# Altium project MB1520.PrjPcb (part 3 of 5)

## Sheet Ethernet.SchDoc: Ethernet
size A4; CompanyName: STMicroelectronics; Organization: Microcontrollers Division; DocumentNumber: 7; SheetNumber: 5; SheetTotal: 19
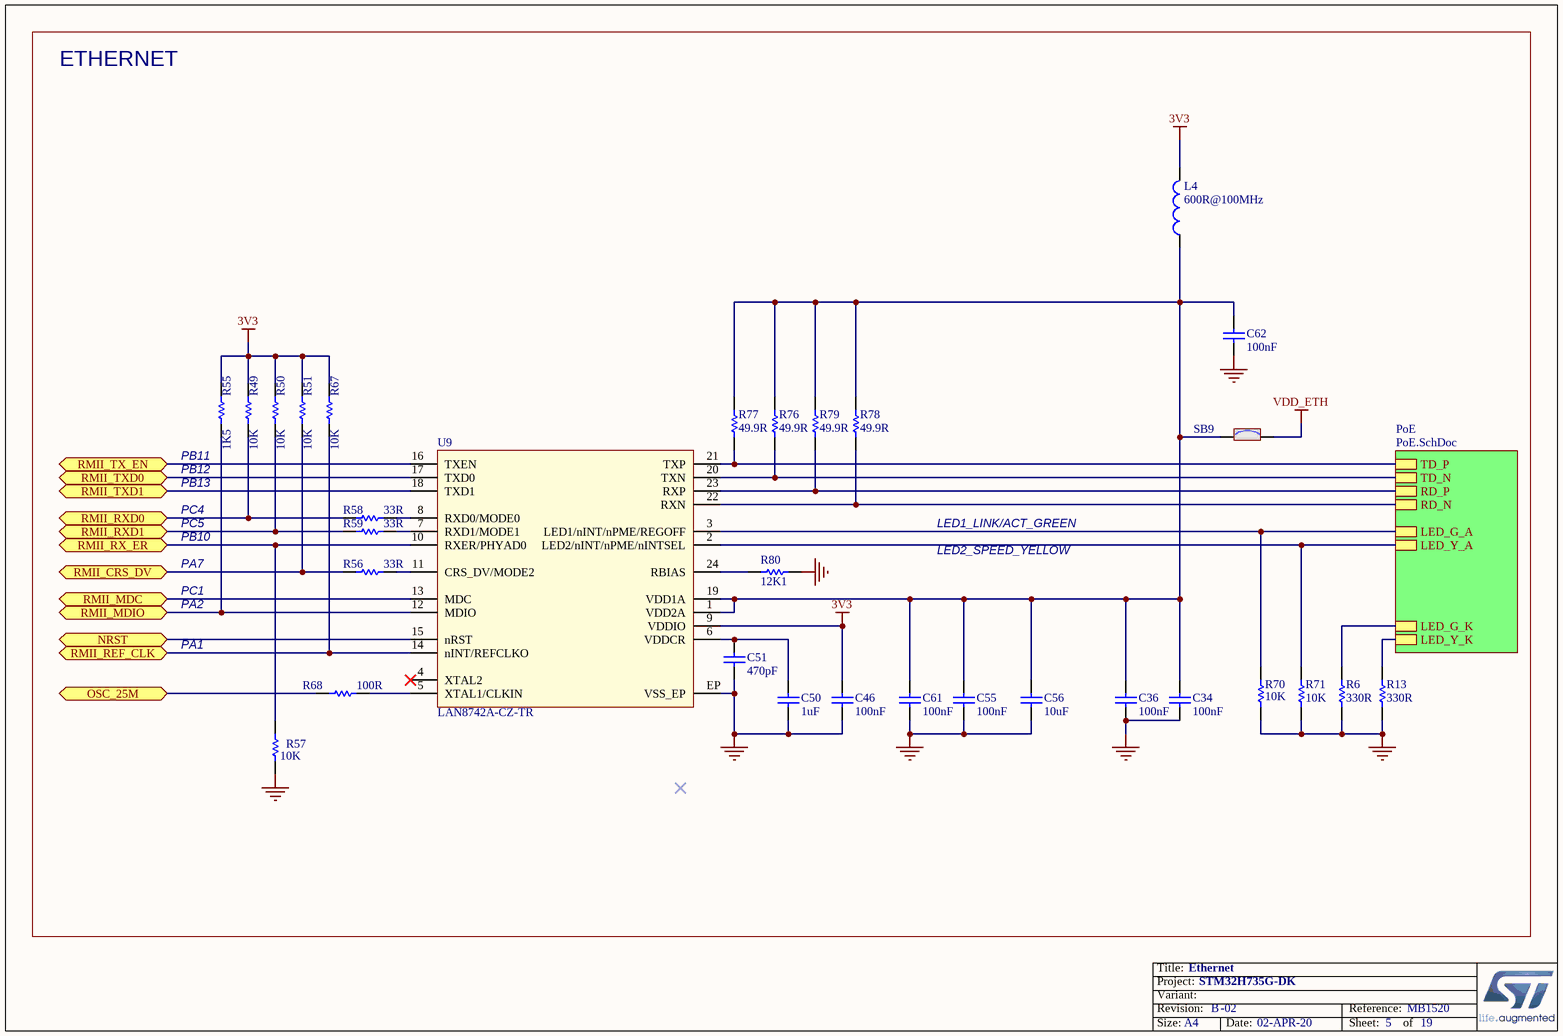
[diagram p9: Ethernet.SchDoc]

### Parts
C34  value 100nF  [C0402]  (hidden comment: Capacitor)
C36  value 100nF  [C0402]  (hidden comment: Capacitor)
C46  value 100nF  [C0402]  (hidden comment: Capacitor)
C50  value 1uF  [C0603]  (hidden comment: Capacitor)
C51  value 470pF  [C0402]  (hidden comment: Capacitor)
C55  value 100nF  [C0402]  (hidden comment: Capacitor)
C56  value 10uF  [C0603]  (hidden comment: Capacitor)
C61  value 100nF  [C0402]  (hidden comment: Capacitor)
C62  value 100nF  [C0402]  (hidden comment: Capacitor)
L4  value 600R@100MHz  [L0603]  (hidden comment: BEAD)
R6  value 330R  [R0402]  (hidden comment: Resistor)
R13  value 330R  [R0402]  (hidden comment: Resistor)
R49  value 10K  [R0402]  (hidden comment: Resistor)
R50  value 10K  [R0402]  (hidden comment: Resistor)
R51  value 10K  [R0402]  (hidden comment: Resistor)
R55  value 1K5  [R0402]  (hidden comment: Resistor)
R56  value 33R  [R0402]  (hidden comment: Resistor)
R57  value 10K  [R0402]  (hidden comment: Resistor)
R58  value 33R  [R0402]  (hidden comment: Resistor)
R59  value 33R  [R0402]  (hidden comment: Resistor)
R67  value 10K  [R0402]  (hidden comment: Resistor)
R68  value 100R  [R0402]  (hidden comment: Resistor)
R70  value 10K  [R0402]  (hidden comment: Resistor)
R71  value 10K  [R0402]  (hidden comment: Resistor)
R76  value 49.9R  [R0402]  (hidden comment: Resistor)
R77  value 49.9R  [R0402]  (hidden comment: Resistor)
R78  value 49.9R  [R0402]  (hidden comment: Resistor)
R79  value 49.9R  [R0402]  (hidden comment: Resistor)
R80  value 12K1  [R0402]  (hidden comment: Resistor)
SB9  SB_ON  [SOLDER-BRIDGE_R0603-0R]  (value not drawn)
U9  LAN8742A-CZ-TR  [ICC_VQFN24-EPAD_4X4_P050]

### Sub-sheets
PoE = PoE.SchDoc: LED_G_A, LED_G_K, LED_Y_A, LED_Y_K, RD_P, TD_N, TD_P, RD_N

### Ports
NRST, OSC_25M, RMII_CRS_DV, RMII_MDC, RMII_MDIO, RMII_REF_CLK, RMII_RX_ER, RMII_RXD0, RMII_RXD1, RMII_TX_EN, RMII_TXD0, RMII_TXD1

### Nets
3V3: C46.1 L4.2 R49.2 R50.2 R51.1 R55.2 R67.1 U9.9(VDDIO)
GND: C34.2 C36.2 C46.2 C50.1 C51.1 C55.2 C56.1 C61.2 C62.1 R6.1 R13.1 R57.2 R70.2 R71.1 R80.2 U9.EP(VSS_EP)  [project net POE7]
VDD_ETH: SB9.2
OSC_25M: R68.1 ; port OSC_25M
RESET: U9.15(nRST) ; port NRST
RMII_CRS_DV: R51.2 R56.1 ; port RMII_CRS_DV
RMII_MDC: U9.13(MDC) ; port RMII_MDC
RMII_MDIO: R55.1 U9.12(MDIO) ; port RMII_MDIO
RMII_REF_CLK: R67.2 U9.14(nINT/REFCLKO) ; port RMII_REF_CLK
RMII_RX_ER: R57.1 U9.10(RXER/PHYAD0) ; port RMII_RX_ER
RMII_RXD0: R49.1 R58.1 ; port RMII_RXD0
RMII_RXD1: R50.1 R59.1 ; port RMII_RXD1
RMII_TX_EN: U9.16(TXEN) ; port RMII_TX_EN
RMII_TXD0: U9.17(TXD0) ; port RMII_TXD0
RMII_TXD1: U9.18(TXD1) ; port RMII_TXD1
NetC34_1: C34.1 C36.1 C55.1 C56.2 C61.1 C62.2 L4.1 R76.2 R77.2 R78.2 R79.2 SB9.1 U9.1(VDD2A) U9.19(VDD1A)
NetC50_2: C50.2 C51.2 U9.6(VDDCR)
NetR6_2: R6.2 ; sheet PoE/LED_G_K
NetR13_2: R13.2 ; sheet PoE/LED_Y_K
NetR56_2: R56.2 U9.11(CRS_DV/MODE2)
NetR58_2: R58.2 U9.8(RXD0/MODE0)
NetR59_2: R59.2 U9.7(RXD1/MODE1)
NetR68_2: R68.2 U9.5(XTAL1/CLKIN)
NetR70_1: R70.1 U9.3(LED1/nINT/nPME/REGOFF) ; sheet PoE/LED_G_A
NetR71_2: R71.2 U9.2(LED2/nINT/nPME/nINTSEL) ; sheet PoE/LED_Y_A
NetR76_1: R76.1 U9.20(TXN) ; sheet PoE/TD_N
NetR77_1: R77.1 U9.21(TXP) ; sheet PoE/TD_P
NetR78_1: R78.1 U9.22(RXN) ; sheet PoE/RD_N
NetR79_1: R79.1 U9.23(RXP) ; sheet PoE/RD_P
NetR80_1: R80.1 U9.24(RBIAS)

Not connected (* = marked no-connect by the designer): U9 4(XTAL2)*

### Notes on the sheet
- ETHERNET
- PB11
- PB12
- PB13
- PC4
- PA7
- PC5
- PB10
- LED1_LINK/ACT_GREEN
- LED2_SPEED_YELLOW
- PA2
- PC1
- PA1
- Title:
- Project:
- Size:
- Revision:
- Variant:
- A4
- -
- Date:
- Reference:
- Sheet:
- of

### Library data of the parts
C34 C36 C46 C55 C61 C62 = MCD-00102: Capacitor, MLCC, 100nF, 16V, X7R, 10%, 0402, T=0,5mm; Manufacturer_Part_Number: CC0402KRX7R7BB104; Manufacturer: YAGEO; Alternate_Manufacturer_Part_Number: GCM155R71C104KA55D; Alternate_Manufacturer: MURATA; Provided_By: SUBCO; Internal_Part_Number: MCD-00102; Status: Released; Part_Type: Capacitor; Package: C0402; ComponentLink1Description: Datasheet; ComponentLink1URL: http://tunmcdsvn.tun.st.com/Component_Datasheet_Library/Trunk/Capacitors/Yageo_Multilayer_Capacitor_X7R_series_100pF_to_22uF
C50 = MCD-00010: Capacitor, MLCC, 1uF, 16V, X5R, 10%, 0603, T=0,8mm; Manufacturer_Part_Number: CC0603KRX5R7BB105; Manufacturer: YAGEO; Provided_By: SUBCO; Internal_Part_Number: MCD-00010; Status: Released; Part_Type: Capacitor; Package: C0603; ComponentLink1Description: Datasheet; ComponentLink1URL: http://tunmcdsvn.tun.st.com/Component_Datasheet_Library/Trunk/Capacitors/Yageo_Multilayer_capacitor_X5R_series_100pF_to_100uF
C51 = MCD-00724: Capacitor, MLCC, 470pF, 50V, NPO, 5%, 0402, T=0,5mm; Manufacturer_Part_Number: CC0402JRNPO9BN471; Manufacturer: YAGEO; Provided_By: SUBCO; Internal_Part_Number: MCD-00724; Status: Released; Part_Type: Capacitor; Package: C0402; ComponentLink1Description: Datasheet; ComponentLink1URL: http://tunmcdsvn.tun.st.com/Component_Datasheet_Library/Trunk/Capacitors/Yageo_Capacitor_NP0_16V-to-50V
C56 = MCD-01124: Capacitor, MLCC, 10uF, 10V, X5R, 10%, 0603, T=0.8mm; Manufacturer_Part_Number: GRM188R61A106KAAL; Manufacturer: MURATA; ECCN_US: EAR99; ECCN_EU: NEC; Provided_By: SUBCO; Internal_Part_Number: MCD-01124; Status: Released; Part_Type: Capacitor; Package: C0603; ComponentLink1Description: Datasheet; ComponentLink1URL: http://tunmcdsvn.tun.st.com/Component_Datasheet_Library/Trunk/Capacitors/Murata_Capacitor_GR_series
L4 = MCD-00047: SMD Chip ferrite bead, 600R@100MHz +/-25%, 350mA, 500mohm DC, 0603, T=0.8mm; Part_Type: Inductor; Manufacturer_Part_Number: FCM1608KF-601T03; Manufacturer: TAI-TECH; Provided_By: SUBCO; Internal_Part_Number: MCD-00047; Status: Released; ComponentLink1Description: Datasheet; ComponentLink1URL: http://tunmcdsvn.tun.st.com/Component_Datasheet_Library/Trunk/Inductors/TaiTech_Bead_FCM1608_series; ECCN_US: n/a; ECCN_EU: n/a
R6 R13 = MCD-00062: Resistor,330R,0402,1%,1/16W; Manufacturer_Part_Number: RC0402FR-07330RL; Manufacturer: YAGEO; Provided_By: SUBCO; Internal_Part_Number: MCD-00062; Status: Released; Part_Type: Resistor; Package: R0402; ComponentLink1Description: Datasheet; ComponentLink1URL: http://tunmcdsvn.tun.st.com/Component_Datasheet_Library/Trunk/Resistors/Yageo_Resistor_RC0402-series
R49-R51 R57 R67 = MCD-00053: Resistor,10K,0402,1%,1/16W; Manufacturer_Part_Number: RC0402FR-0710KL; Manufacturer: YAGEO; ECCN_US: EAR99; ECCN_EU: NEC; Provided_By: SUBCO; Internal_Part_Number: MCD-00053; Status: Released; Part_Type: Resistor; Package: R0402; ComponentLink1Description: Datasheet; ComponentLink1URL: http://tunmcdsvn.tun.st.com/Component_Datasheet_Library/Trunk/Resistors/Yageo_Resistor_RC0402-series
R55 = MCD-00068: Resistor,1K5,0402,1%,1/16W; Manufacturer_Part_Number: RC0402FR-071K5L; Manufacturer: YAGEO; ECCN_US: EAR99; ECCN_EU: NEC; Provided_By: SUBCO; Internal_Part_Number: MCD-00068; Status: Released; Part_Type: Resistor; Package: R0402; ComponentLink1Description: Datasheet; ComponentLink1URL: http://tunmcdsvn.tun.st.com/Component_Datasheet_Library/Trunk/Resistors/Yageo_Resistor_RC0402-series
R56 R58 R59 = MCD-00455: Resistor,33R,0402,1%,1/16W; Manufacturer_Part_Number: RC0402FR-0733RL; Manufacturer: YAGEO; ECCN_US: EAR99; ECCN_EU: NEC; Provided_By: SUBCO; Internal_Part_Number: MCD-00455; Status: Released; Part_Type: Resistor; Package: R0402; ComponentLink1Description: Datasheet; ComponentLink1URL: http://tunmcdsvn.tun.st.com/Component_Datasheet_Library/Trunk/Resistors/Yageo_Resistor_RC0402-series
R68 = MCD-00119: Resistor,100R,0402,1%,1/16W; Manufacturer_Part_Number: RC0402FR-07100RL; Manufacturer: YAGEO; Provided_By: SUBCO; Internal_Part_Number: MCD-00119; Status: Released; Part_Type: Resistor; ComponentLink1Description: Datasheet; Package: R0402; ComponentLink1URL: http://tunmcdsvn.tun.st.com/Component_Datasheet_Library/Trunk/Resistors/Yageo_Resistor_RC0402-series
R70 R71 = MCD-00053: Resistor,10K,0402,1%,1/16W; Manufacturer_Part_Number: RC0402FR-0710KL; Manufacturer: YAGEO; Provided_By: SUBCO; Internal_Part_Number: MCD-00053; Status: Released; Part_Type: Resistor; Package: R0402; ComponentLink1Description: Datasheet; ComponentLink1URL: http://tunmcdsvn.tun.st.com/Component_Datasheet_Library/Trunk/Resistors/Yageo_Resistor_RC0402-series
R76-R79 = MCD-00565: Resistor,49R9,0402,1%,1/16W; Manufacturer_Part_Number: RC0402FR-0749R9L; Manufacturer: YAGEO; Provided_By: SUBCO; Internal_Part_Number: MCD-00565; Status: Released; Part_Type: Resistor; Package: R0402; ComponentLink1Description: Datasheet; ComponentLink1URL: http://tunmcdsvn.tun.st.com/Component_Datasheet_Library/Trunk/Resistors/Yageo_Resistor_RC0402-series
R80 = MCD-00723: Resistor,12K1,0402,1%,1/16W; Manufacturer_Part_Number: RC0402FR-0712K1L; Manufacturer: YAGEO; ECCN_US: EAR99; ECCN_EU: NEC; Provided_By: SUBCO; Internal_Part_Number: MCD-00723; Status: Released; Part_Type: Resistor; Package: R0402; ComponentLink1Description: Datasheet; ComponentLink1URL: http://tunmcdsvn.tun.st.com/Component_Datasheet_Library/Trunk/Resistors/Yageo_Resistor_RC0402-series
SB9 = MCD-00071: as SB6-SB8 on sheet STMod+; Internal_Part_Number: MCD-00071; Status: Released; Package: SB0603; ComponentLink1Description: Datasheet; ComponentLink1URL: http://tunmcdsvn.tun.st.com/Component_Datasheet_Library/Trunk/Resistors/Yageo_Resistor_RC0603-series
U9 = MCD-00719: 10/100M RMII Ethernet transceiver; Part_Type: IC; Manufacturer: MICROCHIP; Provided_By: SUBCO; Internal_Part_Number: MCD-00719; Value: LAN8742A-CZ-TR; Status: Released; Manufacturer_Part_Number: LAN8742A-CZ-TR; ComponentLink1Description: Datasheet; ComponentLink1URL: http://tunmcdsvn.tun.st.com/Component_Datasheet_Library/Trunk/IC/MICROCHIP_LAN8742A_RMII_PHY; ECCN_US: n/a; ECCN_EU: n/a

## Sheet PoE.SchDoc: PoE
size A4; CompanyName: STMicroelectronics; Organization: Microcontrollers Division; DocumentNumber: 13; SheetNumber: 6; SheetTotal: 19
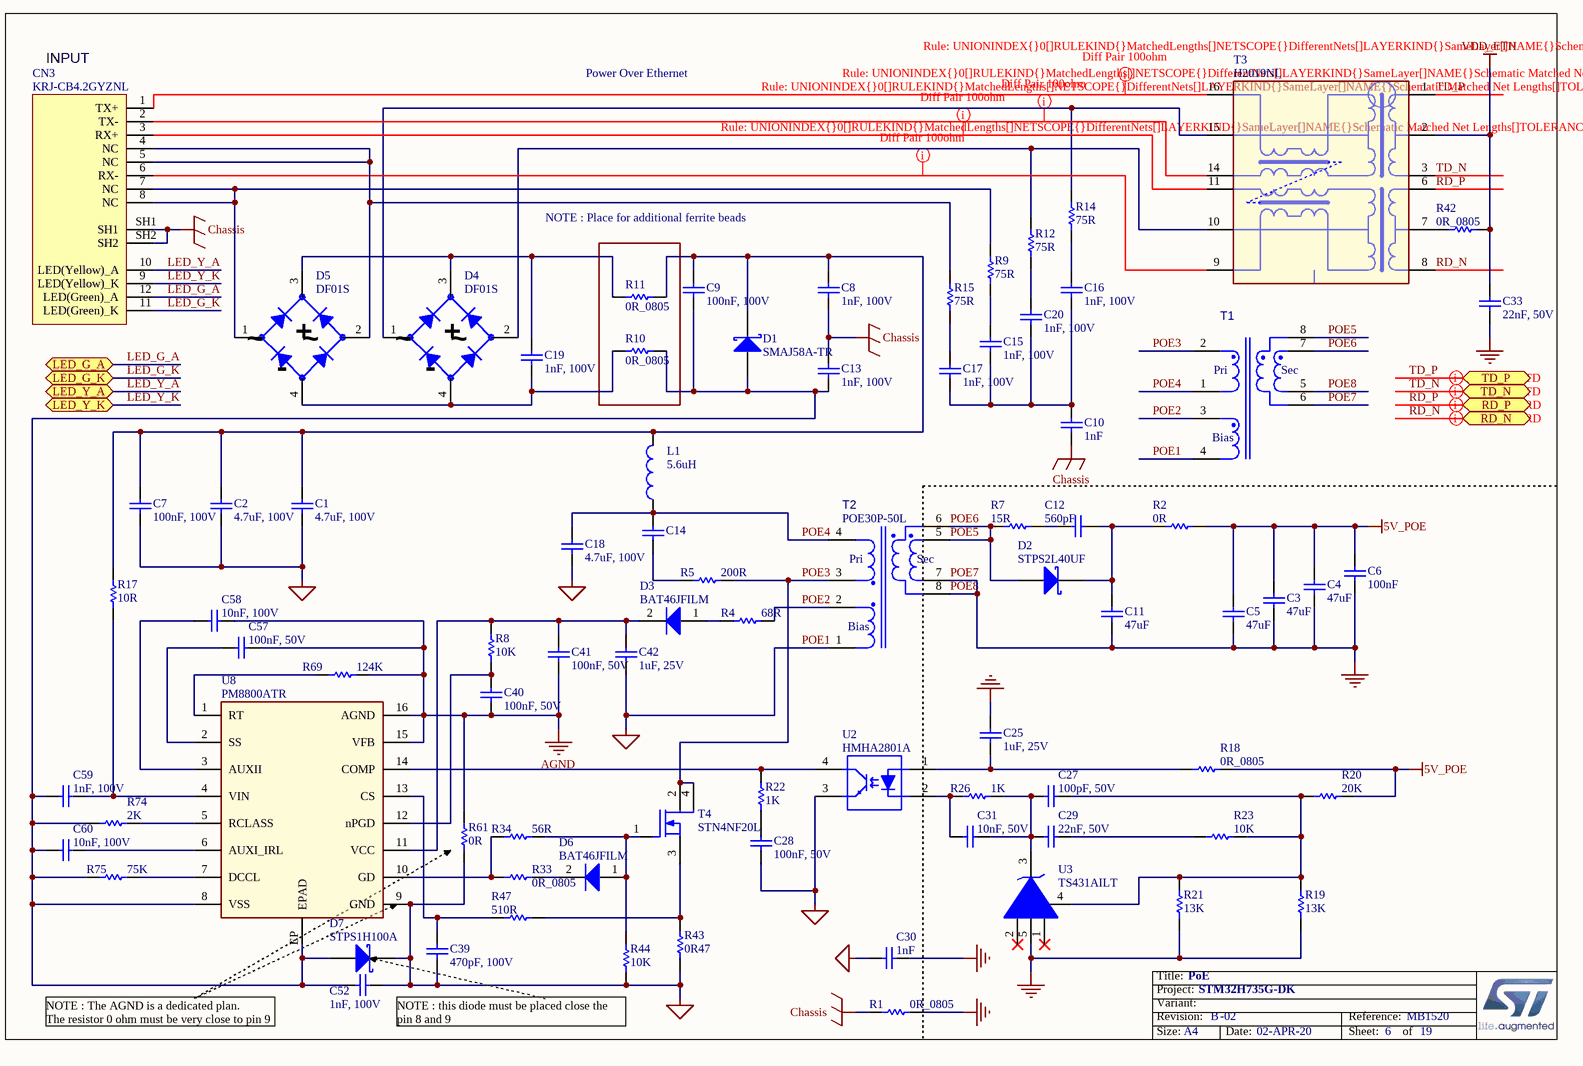
[diagram p10: PoE.SchDoc]

### Parts
C1  value 4.7uF, 100V  [C1210]  (hidden comment: Capacitor)
C2  value 4.7uF, 100V  [C1210]  (hidden comment: Capacitor)
C3  value 47uF  [C0805]  (hidden comment: Capacitor)
C4  value 47uF  [C0805]  (hidden comment: Capacitor)
C5  value 47uF  [C0805]  (hidden comment: Capacitor)
C6  value 100nF  [C0603]  (hidden comment: Capacitor)
C7  value 100nF, 100V  [C0805]  (hidden comment: Capacitor)
C8  value 1nF, 100V  [C0603]  (hidden comment: Capacitor)
C9  value 100nF, 100V  [C0805]  (hidden comment: Capacitor)
C10  value 1nF  [C1206_H1P6]  (hidden comment: Capacitor)
C11  value 47uF  [C0805]  (hidden comment: Capacitor)
C12  value 560pF  [C0603]  (hidden comment: Capacitor)
C13  value 1nF, 100V  [C0603]  (hidden comment: Capacitor)
C14  Capacitor  [C0603]  (value not drawn)
C15  value 1nF, 100V  [C0603]  (hidden comment: Capacitor)
C16  value 1nF, 100V  [C0603]  (hidden comment: Capacitor)
C17  value 1nF, 100V  [C0603]  (hidden comment: Capacitor)
C18  value 4.7uF, 100V  [C1210]  (hidden comment: Capacitor)
C19  value 1nF, 100V  [C0603]  (hidden comment: Capacitor)
C20  value 1nF, 100V  [C0603]  (hidden comment: Capacitor)
C25  value 1uF, 25V  [C0603]  (hidden comment: Capacitor)
C27  value 100pF, 50V  [C0603]  (hidden comment: Capacitor)
C28  value 100nF, 50V  [C0603]  (hidden comment: Capacitor)
C29  value 22nF, 50V  [C0603]  (hidden comment: Capacitor)
C30  value 1nF  [C1206_H1P6]  (hidden comment: Capacitor)
C31  value 10nF, 50V  [C0603]  (hidden comment: Capacitor)
C33  value 22nF, 50V  [C0603]  (hidden comment: Capacitor)
C39  value 470pF, 100V  [C0603]  (hidden comment: Capacitor)
C40  value 100nF, 50V  [C0603]  (hidden comment: Capacitor)
C41  value 100nF, 50V  [C0603]  (hidden comment: Capacitor)
C42  value 1uF, 25V  [C0603]  (hidden comment: Capacitor)
C52  value 1nF, 100V  [C0603]  (hidden comment: Capacitor)
C57  value 100nF, 50V  [C0603]  (hidden comment: Capacitor)
C58  value 10nF, 100V  [C0603]  (hidden comment: Capacitor)
C59  value 1nF, 100V  [C0603]  (hidden comment: Capacitor)
C60  value 10nF, 100V  [C0603]  (hidden comment: Capacitor)
CN3  value KRJ-CB4.2GYZNL  [CON_RJ45_DGKYD_KRJ-CB4.2GYZNL]  (hidden comment: RJ45_KRJ-CB4.2GYZNL)
D1  SMAJ58A-TR  [DIO_SMA_1A_2K]
D2  STPS2L40UF  [DIO_SMB-FLAT_1A_2K]
D3  value BAT46JFILM  [DIO_SOD323_1A_2K]  (hidden comment: DIODE_1A_2K)
D4  DF01S  [BRF_VISHAY_DFS_DF01S]
D5  DF01S  [BRF_VISHAY_DFS_DF01S]
D6  value BAT46JFILM  [DIO_SOD323_1A_2K]  (hidden comment: DIODE_1A_2K)
D7  value STPS1H100A  [DIO_SMA_DO214-AC_1A_2K]  (hidden comment: SMAJ58A-TR)
L1  value 5.6uH  [IND_POWER_COILCRAFT_ME3220]  (hidden comment: Inductor)
R1  value 0R_0805  [R0805]  (hidden comment: Resistor)
R2  value 0R  [R0603]  (hidden comment: Resistor)
R4  value 68R  [R0805]  (hidden comment: Resistor)
R5  value 200R  [R1206_H0P55]  (hidden comment: Resistor)
R7  value 15R  [R0805]  (hidden comment: Resistor)
R8  value 10K  [R0603]  (hidden comment: Resistor)
R9  value 75R  [R0805]  (hidden comment: Resistor)
R10  value 0R_0805  [R0805]  (hidden comment: Resistor)
R11  value 0R_0805  [R0805]  (hidden comment: Resistor)
R12  value 75R  [R0805]  (hidden comment: Resistor)
R14  value 75R  [R0805]  (hidden comment: Resistor)
R15  value 75R  [R0805]  (hidden comment: Resistor)
R17  value 10R  [R0805]  (hidden comment: Resistor)
R18  value 0R_0805  [R0805]  (hidden comment: Resistor)
R19  value 13K  [R0603]  (hidden comment: Resistor)
R20  value 20K  [R0603]  (hidden comment: Resistor)
R21  value 13K  [R0603]  (hidden comment: Resistor)
R22  value 1K  [R0603]  (hidden comment: Resistor)
R23  value 10K  [R0603]  (hidden comment: Resistor)
R26  value 1K  [R0603]  (hidden comment: Resistor)
R33  value 0R_0805  [R0805]  (hidden comment: Resistor)
R34  value 56R  [R0805]  (hidden comment: Resistor)
R42  value 0R_0805  [R0805]  (hidden comment: Resistor)
R43  value 0R47  [R1206_H0P55]  (hidden comment: Resistor)
R44  value 10K  [R0603]  (hidden comment: Resistor)
R47  value 510R  [R0603]  (hidden comment: Resistor)
R61  value 0R  [R0603]  (hidden comment: Resistor)
R69  value 124K  [R0603]  (hidden comment: Resistor)
R74  value 2K  [R0805]  (hidden comment: Resistor)
R75  value 75K  [R0603]  (hidden comment: Resistor)
T1  TRS_750315923  [TRS_WURTH_750315923]  (value not drawn)
T2  POE30P-50L  [TRS_COILCRAFT_POE30P-50L]
T3  H2019NL  [TRS_PULSE_H2019NL]
T4  STN4NF20L  [MOS_SOT223-TAB]
U2  HMHA2801A  [OPT_MINI-FLAT_FAIRCHILD_HMHA2801A]
U3  TS431AILT  [MOS_SOT23-5L]
U8  PM8800ATR  [ICC_HTSSOP16-EPAD_5X4P4_P065]

### Ports
LED_G_A, LED_G_K, LED_Y_A, LED_Y_K, RD_N, RD_P, TD_N, TD_P

### Nets
5V_POE: C3.2 C4.2 C5.2 C6.2 R2.2 R18.2 R20.2
AGND: C40.1 C41.1 C57.2 C58.2 R61.2 R69.2 U8.15(VFB) U8.16(AGND)
Chassis: C8.1 C10.1 C13.2 CN3.SH1 CN3.SH2 R1.1
POE1: C1.1 C2.1 C7.1 C18.1 C28.1 C30.1 C39.1 C42.1 C52.1 D7.2(K) R43.1 R44.1 R61.1 T1.4 T2.1 U2.3(Emitter) U8.9(GND)  [also labelled GND_POWER_IN]
POE7: C3.1 C4.1 C5.1 C6.1 C11.1 C25.2 C30.2 C33.1 R1.2 R19.2 R21.1 T1.5 T1.6 T2.7 T2.8 U3.5(A)  [also labelled GND, POE8]
VDD_ETH: C33.2 R42.2 T3.2(tct)
LED_G_A: CN3.12(LED(Green)_A) ; port LED_G_A
LED_G_K: CN3.11(LED(Green)_K) ; port LED_G_K
LED_Y_A: CN3.10(LED(Yellow)_A) ; port LED_Y_A
LED_Y_K: CN3.9(LED(Yellow)_K) ; port LED_Y_K
POE2: R4.2 T1.3 T2.2
POE3: R5.2 T1.2 T2.3 T4.2(D) T4.4(D)
POE4: C14.2 C18.2 L1.1 T1.1 T2.4
POE5: D2.1(A) R7.1 T1.7 T1.8 T2.5 T2.6  [also labelled POE6]
RD_N: T3.8(rd-) ; port RD_N
RD_P: T3.6(rd+) ; port RD_P
TD_N: T3.3(td-) ; port TD_N
TD_P: T3.1(td+) ; port TD_P
NetC1_2: C1.2 C2.2 C7.2 C8.2 C9.1 D1.2(K) L1.2 R11.2 R17.2
NetC9_2: C9.2 C13.1 C52.2 C59.2 C60.1 D1.1(A) D7.1(A) R10.2 R74.1 R75.1 U8.8(VSS) U8.EP(EPAD)
NetC10_2: C10.2 C15.1 C16.1 C17.1 C20.1
NetC11_2: C11.2 C12.2 D2.2(K) R2.1
NetC12_1: C12.1 R7.2
NetC14_1: C14.1 R5.1
NetC15_2: C15.2 R9.1
NetC16_2: C16.2 R14.1
NetC17_2: C17.2 R15.1
NetC19_1: C19.1 D4.4(DC_OUT_MINUS) D5.4(DC_OUT_MINUS) R10.1
NetC19_2: C19.2 D4.3(DC_OUT_PLUS) D5.3(DC_OUT_PLUS) R11.1
NetC20_2: C20.2 R12.1
NetC25_1: C25.1 R18.1 U2.1(Anode)
NetC27_1: C27.1 C29.1 C31.2 R26.1 U3.3(K)
NetC27_2: C27.2 R19.1 R20.1 R21.2 R23.1 U3.4(REF)
NetC28_2: C28.2 R22.1
NetC29_2: C29.2 R23.2
NetC31_1: C31.1 R26.2 U2.2(B)
NetC39_2: C39.2 R47.1 U8.13(CS)
NetC40_2: C40.2 R8.1 U8.12(nPGD)
NetC41_2: C41.2 C42.2 D3.2(K) R8.2 U8.11(VCC)
NetC57_1: C57.1 U8.2(SS)
NetC58_1: C58.1 U8.3(AUXII)
NetC59_1: C59.1 R17.1 U8.4(VIN)
NetC60_2: C60.2 U8.6(AUXI_IRL)
NetCN3_1: CN3.1(TX+) T3.16(tx1+)
NetCN3_2: CN3.2(TX-) T3.14(tx1-)
NetCN3_3: CN3.3(RX+) T3.11(rx1+)
NetCN3_4: CN3.4(NC) CN3.5(NC) D5.2(AC_IN_2) R15.2
NetCN3_6: CN3.6(RX-) T3.9(rx-)
NetCN3_7: CN3.7(NC) CN3.8(NC) D5.1(AC_IN_1) R9.2
NetD3_1: D3.1(A) R4.1
NetD4_1: D4.1(AC_IN_1) R14.2 T3.15(txct)
NetD4_2: D4.2(AC_IN_2) R12.2 T3.10(rxct)
NetD6_1: D6.1(A) R34.2 R44.2 T4.1(G)
NetD6_2: D6.2(K) R33.1
NetR22_2: R22.2 U2.4(Collector) U8.14(COMP)
NetR33_2: R33.2 R34.1 U8.10(GD)
NetR42_1: R42.1 T3.7(rct)
NetR43_2: R43.2 R47.2 T4.3(S)
NetR69_1: R69.1 U8.1(RT)
NetR74_2: R74.2 U8.5(RCLASS)
NetR75_2: R75.2 U8.7(DCCL)

Not connected (* = marked no-connect by the designer): U3 1(NC)* 2(NC)*

### Layout directives
differential pair: RD_N, RD_P, TD_N, TD_P
rule Matched Net Lengths [Tolerance = 100mil]: NetCN3_1, NetCN3_2, NetCN3_3, NetCN3_6

### Notes on the sheet
- INPUT
- Power Over Ethernet
- NOTE : Place for additional ferrite beads
- NOTE : The AGND is a dedicated plan.
  The resistor 0 ohm must be very close to pin 9
- NOTE : this diode must be placed close the pin 8 and 9
- Title:
- Project:
- Size:
- Revision:
- Variant:
- A4
- -
- Date:
- Reference:
- Sheet:
- of
- (in symbol MCD-01063) Pri; Sec; Bias
- (in symbol MCD-01065) ~; +; -
- (in symbol MCD-01081) Pri; Sec; Bias

### Library data of the parts
C1 C2 C18 = MCD-01172: Capacitor,4.7uF,100V, X7S,20%,1210; Manufacturer_Part_Number: 12101Z475MAT2A; Manufacturer: AVX; Provided_By: SUBCO; Internal_Part_Number: MCD-01172; Status: Footprint available; Part_Type: Capacitor; Package: C1210; ComponentLink1Description: Datasheet; ComponentLink1URL: http://tunmcdsvn.tun.st.com/Component_Datasheet_Library/Trunk/Capacitors/AVX_Capacitor_X7S-Dielectric/AVX_Capacitor_X7S-Dielectric.pdf
C3-C5 C11 = MCD-00204: Capacitor, MLCC, 47uF, 10V, X5R, 20%, 0805, T=1,25mm; Manufacturer_Part_Number: GRM21BR61A476ME15K; Manufacturer: MURATA; Provided_By: SUBCO; Internal_Part_Number: MCD-00204; Status: Footprint available; Part_Type: Capacitor; Package: C0805; ComponentLink1Description: Datasheet; ComponentLink1URL: http://tunmcdsvn.tun.st.com/Component_Datasheet_Library/Trunk/Capacitors/Murata_Capacitor_GR_series
C6 = MCD-00211: Capacitor, MLCC, 100nF, 16V, X7R, 10%, 0603, T=0,8mm; Manufacturer_Part_Number: CC0603KRX7R7BB104; Manufacturer: YAGEO; Provided_By: SUBCO; Internal_Part_Number: MCD-00211; Status: Released; Part_Type: Capacitor; Package: C0603; ComponentLink1Description: Datasheet; ComponentLink1URL: http://tunmcdsvn.tun.st.com/Component_Datasheet_Library/Trunk/Capacitors/Yageo_Multilayer_Capacitor_X7R_series_100pF_to_22uF
C7 C9 = MCD-01093: Capacitor,100nF,100V,X7R,10%,0805; Manufacturer_Part_Number: C2012X7R2A104K125AA; Manufacturer: TDK; Provided_By: SUBCO; Internal_Part_Number: MCD-01093; Status: Footprint available; Part_Type: Capacitor; Package: C0805; ComponentLink1Description: Datasheet; ComponentLink1URL: http://tunmcdsvn.tun.st.com/Component_Datasheet_Library/Trunk/Capacitors/TDK_Capacitor_C-series%20Commercial%20Grade%20Mid%20Voltage%20(100%20to%20630V)/TDK_Capacitor_C-series%20Commercial%20Grade%20Mid%20Voltage%20(100%20to%20630V).pdf
C8 C13 C15-C17 C19 C20 C52 C59 = MCD-01091: Capacitor,1nF,100V,X7R,10%,0603; Manufacturer_Part_Number: CC0603KRX7R0BB102; Manufacturer: YAGEO; Provided_By: SUBCO; Internal_Part_Number: MCD-01091; Status: Footprint available; Part_Type: Capacitor; Package: C0603; ComponentLink1Description: Datasheet; ComponentLink1URL: http://tunmcdsvn.tun.st.com/Component_Datasheet_Library/Trunk/Capacitors/Yageo_Multilayer_Capacitor_NPO_X7R_100V_to_630V_0.47pF%20to%202.2uF/Yageo_Multilayer_Capacitor_NPO_X7R_100V_to_630V_0.47pF%20to%202.2uF.pdf
C10 C30 = MCD-00722: Capacitor, MLCC, 1nF, 2KV, X7R, 10%, 1206, T=1,25mm; Manufacturer_Part_Number: CC1206KKX7RDBB102; Manufacturer: YAGEO; Provided_By: SUBCO; Internal_Part_Number: MCD-00722; Status: Released; Part_Type: Capacitor; Package: C1206; ComponentLink1Description: Datasheet; ComponentLink1URL: http://tunmcdsvn.tun.st.com/Component_Datasheet_Library/Trunk/Capacitors/Yageo_Multilayer_Capacitor_NPO_X7R_1KV_to_3KV_10pF_to_33nF/
C12 = MCD-01095: Capacitor,560pF,16V,X7R,10%,0603; Manufacturer_Part_Number: 0603YC561KAT2A; Manufacturer: AVX; Provided_By: SUBCO; Internal_Part_Number: MCD-01095; Status: Footprint available; Part_Type: Capacitor; Package: C0603; ComponentLink1Description: Datasheet; ComponentLink1URL: http://tunmcdsvn.tun.st.com/Component_Datasheet_Library/Trunk/Capacitors/AVX_Capacitor_X7R-series/AVX_X7R-series.pdf
C14 = MCD-01096: Capacitor,27pF,100V,NPO,5%,0603; Manufacturer_Part_Number: CC0603JRNPO0BN270; Manufacturer: YAGEO; Provided_By: SUBCO; Internal_Part_Number: MCD-01096; Value: 27pF, 100V; Status: Footprint available; Part_Type: Capacitor; Package: C0603; ComponentLink1Description: Datasheet; ComponentLink1URL: http://tunmcdsvn.tun.st.com/Component_Datasheet_Library/Trunk/Capacitors/Yageo_Multilayer_Capacitor_NPO_X7R_100V_to_630V_0.47pF%20to%202.2uF/Yageo_Multilayer_Capacitor_NPO_X7R_100V_to_630V_0.47pF%20to%202.2uF.pdf
C25 C42 = MCD-01100: Capacitor,1uF,25V,X5R,10%,0603; Manufacturer_Part_Number: CC0603KRX5R8BB105; Manufacturer: YAGEO; Provided_By: SUBCO; Internal_Part_Number: MCD-01100; Status: Footprint available; Part_Type: Capacitor; Package: C0603; ComponentLink1Description: Datasheet; ComponentLink1URL: http://tunmcdsvn.tun.st.com/Component_Datasheet_Library/Trunk/Capacitors/Yageo_Multilayer_capacitor_X5R_series_100pF_to_100uF/Yageo_Multilayer_capacitor_X5R_100pF_to_100uF.pdf
C27 = MCD-01101: Capacitor,100pF,50V,X7R,10%,0603; Manufacturer_Part_Number: 06035C101JAT4A; Manufacturer: AVX; Provided_By: SUBCO; Internal_Part_Number: MCD-01101; Status: Footprint available; Part_Type: Capacitor; Package: C0603; ComponentLink1Description: Datasheet; ComponentLink1URL: http://tunmcdsvn.tun.st.com/Component_Datasheet_Library/Trunk/Capacitors/AVX_Capacitor_X7R-series/AVX_X7R-series.pdf
C28 C40 C41 C57 = MCD-01099: Capacitor,100nF,50V,X7R,10%,0603; Manufacturer_Part_Number: CC0603KRX7R9BB104; Manufacturer: YAGEO; Provided_By: SUBCO; Internal_Part_Number: MCD-01099; Status: Footprint available; Part_Type: Capacitor; Package: C0603; ComponentLink1Description: Datasheet; ComponentLink1URL: http://tunmcdsvn.tun.st.com/Component_Datasheet_Library/Trunk/Capacitors/Yageo_Multilayer_Capacitor_X7R_series_100pF_to_22uF/Yageo_Mutilayer_Capacitor_X7R_100pF_to_22uF.pdf
C29 C33 = MCD-01103: Capacitor,22nF,50V,X7R,10%,0603; Manufacturer_Part_Number: CC0603KRX7R9BB223; Manufacturer: YAGEO; Provided_By: SUBCO; Internal_Part_Number: MCD-01103; Status: Footprint available; Part_Type: Capacitor; Package: C0603; ComponentLink1Description: Datasheet; ComponentLink1URL: http://tunmcdsvn.tun.st.com/Component_Datasheet_Library/Trunk/Capacitors/Yageo_Multilayer_Capacitor_X7R_series_100pF_to_22uF/Yageo_Mutilayer_Capacitor_X7R_100pF_to_22uF.pdf
C31 = MCD-01102: Capacitor,10nF,50V,X7R,10%,0603; Manufacturer_Part_Number: CC0603KRX7R9BB103; Manufacturer: YAGEO; Provided_By: SUBCO; Internal_Part_Number: MCD-01102; Status: Footprint available; Part_Type: Capacitor; Package: C0603; ComponentLink1Description: Datasheet; ComponentLink1URL: http://tunmcdsvn.tun.st.com/Component_Datasheet_Library/Trunk/Capacitors/Yageo_Multilayer_Capacitor_X7R_series_100pF_to_22uF/Yageo_Mutilayer_Capacitor_X7R_100pF_to_22uF.pdf
C39 = MCD-01104: Capacitor,470pF,100V,X7R,10%,0603; Manufacturer_Part_Number: 06031C471KAT2A; Manufacturer: AVX; Provided_By: SUBCO; Internal_Part_Number: MCD-01104; Status: Footprint available; Part_Type: Capacitor; Package: C0603; ComponentLink1Description: Datasheet; ComponentLink1URL: http://tunmcdsvn.tun.st.com/Component_Datasheet_Library/Trunk/Capacitors/AVX_Capacitor_X7S-Dielectric/AVX_Capacitor_X7S-Dielectric.pdf
C58 C60 = MCD-01098: Capacitor,10nF,100V,X7R,10%,0603; Manufacturer_Part_Number: CC0603KRX7R0BB103; Manufacturer: YAGEO; Provided_By: SUBCO; Internal_Part_Number: MCD-01098; Status: Footprint available; Part_Type: Capacitor; Package: C0603; ComponentLink1Description: Datasheet; ComponentLink1URL: http://tunmcdsvn.tun.st.com/Component_Datasheet_Library/Trunk/Capacitors/Yageo_Multilayer_Capacitor_NPO_X7R_100V_to_630V_0.47pF%20to%202.2uF/Yageo_Multilayer_Capacitor_NPO_X7R_100V_to_630V_0.47pF%20to%202.2uF.pdf
CN3 = MCD-00717: RJ45 jack, single port, with LEDS, Metal shielded dip low profile; Part_Type: Connector; Manufacturer: DONGGUAN KEYOUDA ELECTRONIC TECHNOLOGY; Provided_By: SUBCO; Internal_Part_Number: MCD-00717; Status: Released; Manufacturer_Part_Number: KRJ-CB4.2GYZNL; ComponentLink1Description: Datasheet; ComponentLink1URL: http://tunmcdsvn.tun.st.com/Component_Datasheet_Library/Trunk/Connectors/DGKYD_RJ45_KRJ-CB4.2GYZNL
D1 = MCD-01083: Transil 400W, VRM=58V; Part_Type: Diode; Manufacturer: STMICROELECTRONICS; BMS_Part_Number: 9151124; Provided_By: SUBCO with ST control; Internal_Part_Number: MCD-01083; Value: SMAJ58A-TR; Status: Footprint available; Manufacturer_Part_Number: SMAJ58A-TR; Package: SMA; ComponentLink1Description: Datasheet; ComponentLink1URL: http://tunmcdsvn.tun.st.com/Component_Datasheet_Library/Trunk/Diodes/STM_Diode_SMAJ58A-TR/STM_Diode_SMAJ58A-TR.pdf
D2 = MCD-01087: Low drop power Schottky rectifier(2A, 40V, 0.34V); Part_Type: Diode; Manufacturer: STMICROELECTRONICS; BMS_Part_Number: 9151009; Provided_By: SUBCO with ST control; Internal_Part_Number: MCD-01087; Value: STPS2L40UF; Status: Footprint available; Manufacturer_Part_Number: STPS2L40UF; Package: SMBflat; ComponentLink1Description: Datasheet; ComponentLink1URL: http://tunmcdsvn.tun.st.com/Component_Datasheet_Library/Trunk/Diodes/STM_Schottky_STPS2L40UF/STM_Schottky_STPS2L40UF.pdf
D3 D6 = MCD-01064: Schottky Single diode,150mA, 100V; Manufacturer: STMICROELECTRONICS; BMS_Part_Number: 9151125; Provided_By: SUBCO with ST control; Internal_Part_Number: MCD-01064; Status: Footprint available; Part_Type: Diode; Manufacturer_Part_Number: BAT46JFILM; Package: SOD-323; ComponentLink1Description: Datasheet; ComponentLink1URL: http://tunmcdsvn.tun.st.com/Component_Datasheet_Library/Trunk/Diodes/STM_Diode_BAT60JFILM-SOD323/STM_Diode_BAT60JFILM-SOD323.pdf
D4 D5 = MCD-01065: Surface Mount Bridge Rectifiers; Part_Type: IC; Manufacturer: VISHAY; Provided_By: SUBCO; Internal_Part_Number: MCD-01065; Value: DF01S; Status: Footprint available; Manufacturer_Part_Number: DF01S; Package: DFS; ComponentLink1Description: Datasheet; ComponentLink1URL: http://tunmcdsvn.tun.st.com/Component_Datasheet_Library/Trunk/IC/Vishay_Rectifiers_DF01S/Vishay_Rectifiers_DF01S.pdf
D7 = MCD-01165: High voltage power Schottky rectifier; Part_Type: Diode; Manufacturer: STMICROELECTRONICS; BMS_Part_Number: 9151102; Provided_By: SUBCO with ST control; Internal_Part_Number: MCD-01165; Status: Footprint available; Manufacturer_Part_Number: STPS1H100A; ComponentLink1Description: Datasheet; ComponentLink1URL: http://tunmcdsvn.tun.st.com/Component_Datasheet_Library/Trunk/Diodes/STM_SCHOTTKY_STPS1H100A/STM_SCHOTTKY_STPS1H100A.pdf
L1 = MCD-01109: Power Inductor, 5.6uH, 0.2R, ME3220-562ML; Manufacturer: COILCRAFT; Provided_By: SUBCO; Internal_Part_Number: MCD-01109; Status: Footprint available; Part_Type: Inductor; Manufacturer_Part_Number: ME3220-562ML; ComponentLink1Description: Datasheet; ComponentLink1URL: http://tunmcdsvn.tun.st.com/Component_Datasheet_Library/Trunk/Inductors/CoilCraft_SMT%20Power%20Inductor%20ME3220/CoilCraft_SMT%20Power%20Inductor%20ME3220.pdf
R1 R10 R11 R18 R33 R42 = MCD-00179: Resistor,0R,0805,5%; Manufacturer_Part_Number: RC0805JR-070RL; Manufacturer: YAGEO; Provided_By: SUBCO; Internal_Part_Number: MCD-00179; Status: Released; Part_Type: Resistor; Package: R0805; ComponentLink1Description: Datasheet; ComponentLink1URL: http://tunmcdsvn.tun.st.com/Component_Datasheet_Library/Trunk/Resistors/Yageo_Resistor_RC0805-series
R2 R61 = MCD-00056: Resistor,0R,0603,5%,1/10W; Manufacturer_Part_Number: RC0603JR-070RL; Manufacturer: YAGEO; Provided_By: SUBCO; Internal_Part_Number: MCD-00056; Status: Released; Part_Type: Resistor; Package: R0603; ComponentLink1Description: Datasheet; ComponentLink1URL: http://tunmcdsvn.tun.st.com/Component_Datasheet_Library/Trunk/Resistors/Yageo_Resistor_RC0603-series
R4 = MCD-01115: Resistor,68R,0805,1%; Manufacturer_Part_Number: RC0805FR-0768RL; Manufacturer: YAGEO; Provided_By: SUBCO; Internal_Part_Number: MCD-01115; Status: Footprint available; Part_Type: Resistor; Package: R0805; ComponentLink1Description: Datasheet; ComponentLink1URL: http://tunmcdsvn.tun.st.com/Component_Datasheet_Library/Trunk/Resistors/Yageo_Resistor_RC0805-series/Yageo_Resistor_RC0805-series.pdf
R5 = MCD-01114: Resistor,200R,1206,1%; Manufacturer_Part_Number: LTR18EZPF2000; Manufacturer: ROHM; Provided_By: SUBCO; Internal_Part_Number: MCD-01114; Status: Footprint available; Part_Type: Resistor; Package: R1206; ComponentLink1Description: Datasheet; ComponentLink1URL: http://tunmcdsvn.tun.st.com/Component_Datasheet_Library/Trunk/Resistors/ROHM_Resistor_LTR-series/ROHM_Resistor_LTR-series.pdf
R7 = MCD-01113: Resistor,15R,0805,1%; Manufacturer_Part_Number: RC0805FR-0715RL; Manufacturer: YAGEO; Provided_By: SUBCO; Internal_Part_Number: MCD-01113; Status: Footprint available; Part_Type: Resistor; Package: R0805; ComponentLink1Description: Datasheet; ComponentLink1URL: http://tunmcdsvn.tun.st.com/Component_Datasheet_Library/Trunk/Resistors/Yageo_Resistor_RC0805-series/Yageo_Resistor_RC0805-series.pdf
R8 R23 R44 = MCD-00220: Resistor,10K,0603,1%,1/10W; Manufacturer_Part_Number: RC0603FR-0710KL; Manufacturer: YAGEO; Provided_By: SUBCO; Internal_Part_Number: MCD-00220; Status: Released; Part_Type: Resistor; Package: R0603; ComponentLink1Description: Datasheet; ComponentLink1URL: http://tunmcdsvn.tun.st.com/Component_Datasheet_Library/Trunk/Resistors/Yageo_Resistor_RC0603-series
R9 R12 R14 R15 = MCD-01112: Resistor,75R,0805,1%; Manufacturer_Part_Number: RC0805FR-0775RL; Manufacturer: YAGEO; Provided_By: SUBCO; Internal_Part_Number: MCD-01112; Status: Footprint available; Part_Type: Resistor; Package: R0805; ComponentLink1Description: Datasheet; ComponentLink1URL: http://tunmcdsvn.tun.st.com/Component_Datasheet_Library/Trunk/Resistors/Yageo_Resistor_RC0805-series/Yageo_Resistor_RC0805-series.pdf
R17 = MCD-01111: Resistor,10R,0805,1%,Stackpole,1/4W; Manufacturer_Part_Number: RNCP0805FTD10R0; Provided_By: SUBCO; Internal_Part_Number: MCD-01111; Status: Footprint available; Part_Type: Resistor; Manufacturer: STACKPOLE; Package: R0805; ComponentLink1Description: Datasheet; ComponentLink1URL: http://tunmcdsvn.tun.st.com/Component_Datasheet_Library/Trunk/Resistors/Stackpole_Resisteor_RNCP%20Series/Stackpole_Resisteor_RNCP%20Series.pdf
R19 R21 = MCD-00384: Resistor,13K,0603,1%,1/10W; Manufacturer_Part_Number: RC0603FR-0713KL; Manufacturer: YAGEO; Provided_By: SUBCO; Internal_Part_Number: MCD-00384; Status: Released; Part_Type: Resistor; Package: R0603; ComponentLink1Description: Datasheet; ComponentLink1URL: http://tunmcdsvn.tun.st.com/Component_Datasheet_Library/Trunk/Resistors/Yageo_Resistor_RC0603-series
R20 = MCD-00422: Resistor,20K,0603,1%,1/10W; Manufacturer_Part_Number: RC0603FR-0720KL; Manufacturer: YAGEO; Provided_By: SUBCO; Internal_Part_Number: MCD-00422; Status: Released; Part_Type: Resistor; Package: R0603; ComponentLink1Description: Datasheet; ComponentLink1URL: http://tunmcdsvn.tun.st.com/Component_Datasheet_Library/Trunk/Resistors/Yageo_Resistor_RC0603-series
R22 R26 = MCD-00070: Resistor,1K,0603,1%,1/10W; Manufacturer_Part_Number: RC0603FR-071KL; Manufacturer: YAGEO; Provided_By: SUBCO; Internal_Part_Number: MCD-00070; Status: Released; Part_Type: Resistor; Package: R0603; ComponentLink1Description: Datasheet; ComponentLink1URL: http://tunmcdsvn.tun.st.com/Component_Datasheet_Library/Trunk/Resistors/Yageo_Resistor_RC0603-series
R34 = MCD-01118: Resistor,56R,0805,1%; Manufacturer_Part_Number: RC0805FR-0756RL; Manufacturer: YAGEO; Provided_By: SUBCO; Internal_Part_Number: MCD-01118; Status: Footprint available; Part_Type: Resistor; Package: R0805; ComponentLink1Description: Datasheet; ComponentLink1URL: http://tunmcdsvn.tun.st.com/Component_Datasheet_Library/Trunk/Resistors/Yageo_Resistor_RC0805-series/Yageo_Resistor_RC0805-series.pdf
R43 = MCD-01119: Resistor,0.47R,1206,1%; Manufacturer_Part_Number: RL1206FR-070R47L; Manufacturer: YAGEO; Provided_By: SUBCO; Internal_Part_Number: MCD-01119; Status: Footprint available; Part_Type: Resistor; Package: R1206; ComponentLink1Description: Datasheet; ComponentLink1URL: http://tunmcdsvn.tun.st.com/Component_Datasheet_Library/Trunk/Resistors/Yageo_Resistor_RL-series/Yageo_Resistor_RL-series.pdf
R47 = MCD-00225: Resistor,510R,0603,1%,1/10W; Manufacturer_Part_Number: RC0603FR-07510RL; Manufacturer: YAGEO; Provided_By: SUBCO; Internal_Part_Number: MCD-00225; Status: Released; Part_Type: Resistor; Package: R0603; ComponentLink1Description: Datasheet; ComponentLink1URL: http://tunmcdsvn.tun.st.com/Component_Datasheet_Library/Trunk/Resistors/Yageo_Resistor_RC0603-series
R69 = MCD-01116: Resistor,124K,0603,1%; Manufacturer_Part_Number: RC0603FR-07124KL; Manufacturer: YAGEO; Provided_By: SUBCO; Internal_Part_Number: MCD-01116; Status: Footprint available; Part_Type: Resistor; Package: R0603; ComponentLink1Description: Datasheet; ComponentLink1URL: http://tunmcdsvn.tun.st.com/Component_Datasheet_Library/Trunk/Resistors/Yageo_Resistor_RC0603-series/Yageo_Resistor_RC0603-series.pdf
R74 = MCD-01117: Resistor,2K,0805,1%; Manufacturer_Part_Number: RC0805FR-072KL; Manufacturer: YAGEO; Provided_By: SUBCO; Internal_Part_Number: MCD-01117; Status: Footprint available; Part_Type: Resistor; Package: R0805; ComponentLink1Description: Datasheet; ComponentLink1URL: http://tunmcdsvn.tun.st.com/Component_Datasheet_Library/Trunk/Resistors/Yageo_Resistor_RC0805-series/Yageo_Resistor_RC0805-series.pdf
R75 = MCD-00522: Resistor,75K,0603,1%,1/10W; Manufacturer_Part_Number: RC0603FR-0775KL; Manufacturer: YAGEO; Provided_By: SUBCO; Internal_Part_Number: MCD-00522; Status: Released; Part_Type: Resistor; Package: R0603; ComponentLink1Description: Datasheet; ComponentLink1URL: http://tunmcdsvn.tun.st.com/Component_Datasheet_Library/Trunk/Resistors/Yageo_Resistor_RC0603-series
T1 = MCD-01063: Flyback Transformers for 3 Watt, PoE applications; Part_Type: IC; Manufacturer: WURTH; Provided_By: SUBCO; Internal_Part_Number: MCD-01063; Value: 750315923; Status: Footprint available; Manufacturer_Part_Number: 750315923; ComponentLink1Description: Datasheet; ComponentLink1URL: http://tunmcdsvn.tun.st.com/Component_Datasheet_Library/Trunk/IC/Wurth_Transformer_750315923/Wurth_Transformer_750315923.pdf
T2 = MCD-01081: Flyback Transformers for 3 Watt, PoE applications, CoilCraft Cyntec; Part_Type: IC; Provided_By: SUBCO; Internal_Part_Number: MCD-01081; Value: POE30P-50L; Status: Footprint available; Manufacturer_Part_Number: POE30P-50L; Manufacturer: COILCRAFT; ComponentLink1Description: Datasheet; ComponentLink1URL: http://tunmcdsvn.tun.st.com/Component_Datasheet_Library/Trunk/IC/CoilCraft_Transformer_POE30P-50L/CoilCraft_Transformer_POE30P-50L.pdf
T3 = MCD-01067: 10/100BASE-TX VoIP Magnetics Modules, Data Transformer; Part_Type: IC; Manufacturer: PULSE; Provided_By: SUBCO; Internal_Part_Number: MCD-01067; Value: H2019NL; Status: Footprint available; Manufacturer_Part_Number: H2019NL; ComponentLink1Description: Datasheet; ComponentLink1URL: http://tunmcdsvn.tun.st.com/Component_Datasheet_Library/Trunk/IC/Pulse_Transformer_H2019NL/Pulse_Transformer_H2019NL.pdf
T4 = MCD-01086: Annel 200 V, 1.1ohm, 1 A, low gate charge STripFET II, Power MOSFET; Part_Type: IC; Manufacturer: STMICROELECTRONICS; BMS_Part_Number: 9153018; Provided_By: SUBCO with ST control; Internal_Part_Number: MCD-01086; Value: STN4NF20L; Status: Footprint available; Manufacturer_Part_Number: STN4NF20L; Package: SOT-223; ComponentLink1Description: Datasheet; ComponentLink1URL: http://tunmcdsvn.tun.st.com/Component_Datasheet_Library/Trunk/IC/STM_N-channel_MOSFET_STN4NF20/STM_N-channel_MOSFET_STN4NF20L.pdf
U2 = MCD-01068: OPTOISOLATOR 3.7KV TRANSISTOR 4SMD; Part_Type: IC; Manufacturer: FAIRCHILD; Provided_By: SUBCO; Internal_Part_Number: MCD-01068; Value: HMHA2801A; Status: Footprint available; Manufacturer_Part_Number: HMHA2801A; ComponentLink1Description: Datasheet; ComponentLink1URL: http://tunmcdsvn.tun.st.com/Component_Datasheet_Library/Trunk/IC/Fairchild_Optocoupler_HMHA2801/Fairchild_Optocoupler_HMHA2801.pdf
U3 = MCD-01089: Low voltage adjustable shunt reference; Part_Type: IC; Manufacturer: STMICROELECTRONICS; BMS_Part_Number: 9177032; Provided_By: SUBCO with ST control; Internal_Part_Number: MCD-01089; Value: TS431AILT; Status: Footprint available; Manufacturer_Part_Number: TS431AILT; Package: SOT23-5; ComponentLink1Description: Datasheet; ComponentLink1URL: http://tunmcdsvn.tun.st.com/Component_Datasheet_Library/Trunk/IC/STM_shunt%20voltage%20reference_TS431AILT/STM_shunt%20voltage%20reference_TS431AILT.pdf
U8 = MCD-01080: Integrated IEEE 802.3af compliant PoE-PD interface, and PWM controller with support of external source; Part_Type: IC; Manufacturer: STMICROELECTRONICS; BMS_Part_Number: 9177966; Provided_By: SUBCO with ST control; Internal_Part_Number: MCD-01080; Value: PM8800ATR; Status: Footprint available; Manufacturer_Part_Number: PM8800ATR; Package: HTSSOP16; ComponentLink1Description: Datasheet; ComponentLink1URL: http://tunmcdsvn.tun.st.com/Component_Datasheet_Library/Trunk/IC/STM_PWM%20Controller_PM8800ATR/STM_PWM%20Controller_PM8800ATR.pdf

## Sheet FDCAN.SchDoc: CAN FD
size A4; CompanyName: STMicroelectronics; Organization: Microcontrollers Division; DocumentNumber: 18; SheetNumber: 8; SheetTotal: 19
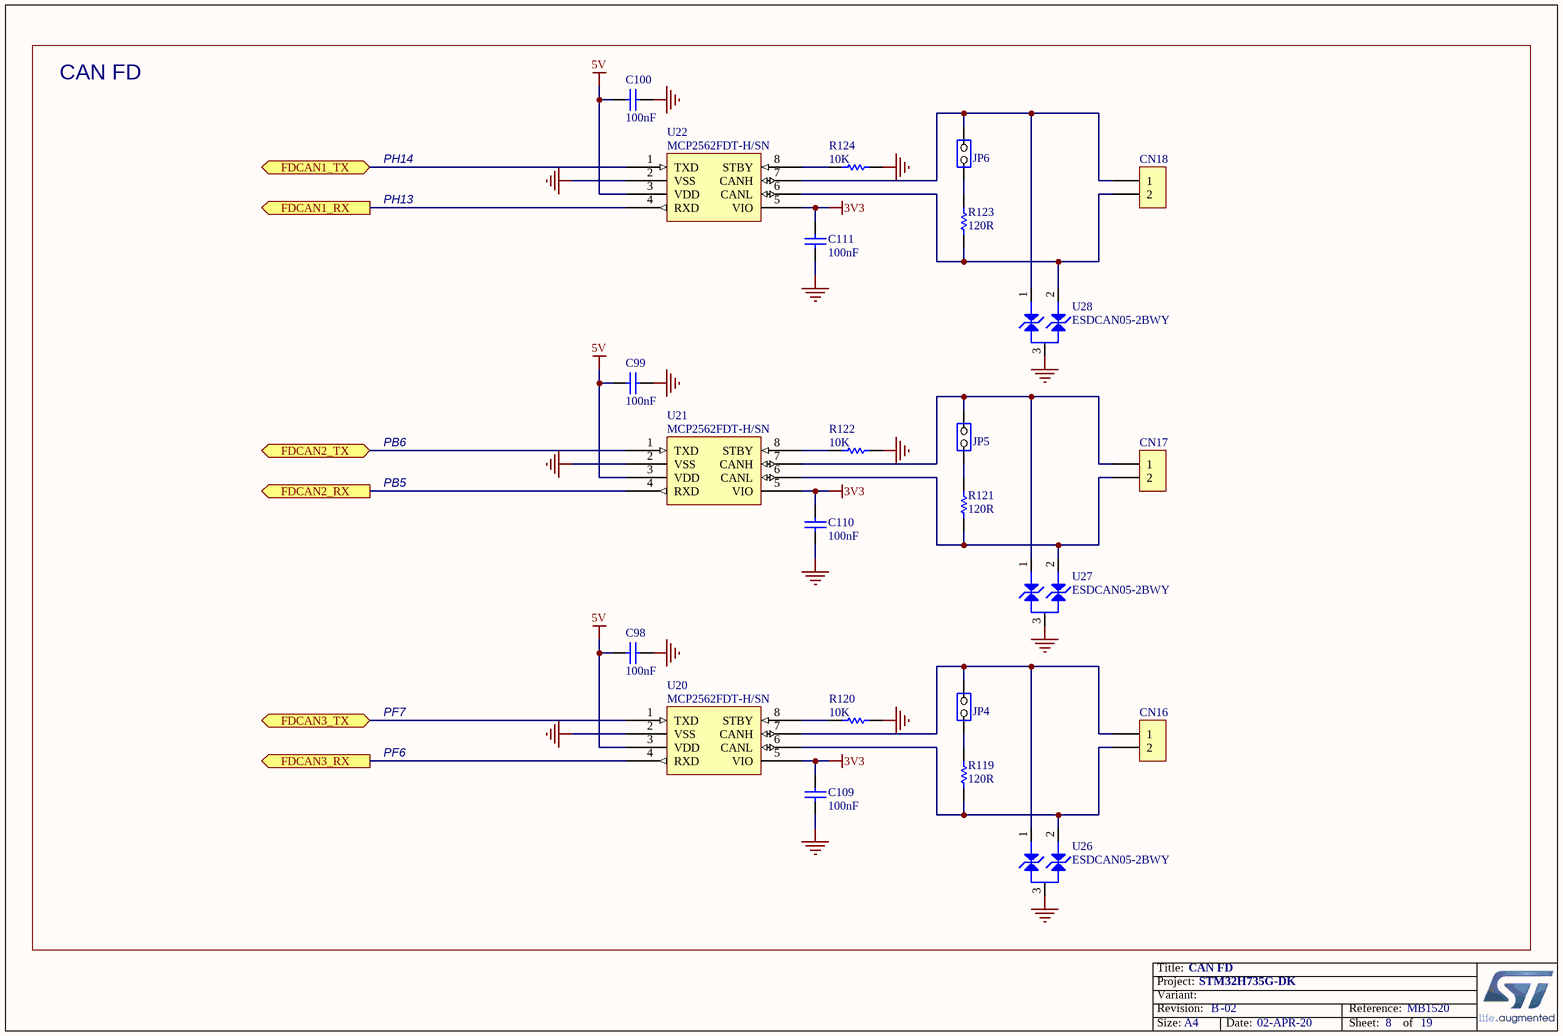
[diagram p11: FDCAN.SchDoc]

### Parts
C98  value 100nF  [C0402]  (hidden comment: Capacitor)
C99  value 100nF  [C0402]  (hidden comment: Capacitor)
C100  value 100nF  [C0402]  (hidden comment: Capacitor)
C109  value 100nF  [C0402]  (hidden comment: Capacitor)
C110  value 100nF  [C0402]  (hidden comment: Capacitor)
C111  value 100nF  [C0402]  (hidden comment: Capacitor)
CN16  Header 2x1  [CON_988-JIUBABA_PHFS25-11-02-G0B115-T-1]  (value not drawn)
CN17  Header 2x1  [CON_988-JIUBABA_PHFS25-11-02-G0B115-T-1]  (value not drawn)
CN18  Header 2x1  [CON_988-JIUBABA_PHFS25-11-02-G0B115-T-1]  (value not drawn)
JP4  Jumper_Header 2x1  [CON_SAMTEC_TSW-102-07-G-S]  (value not drawn)
JP5  Jumper_Header 2x1  [CON_SAMTEC_TSW-102-07-G-S]  (value not drawn)
JP6  Jumper_Header 2x1  [CON_SAMTEC_TSW-102-07-G-S]  (value not drawn)
R119  value 120R  [R0402]  (hidden comment: Resistor)
R120  value 10K  [R0402]  (hidden comment: Resistor)
R121  value 120R  [R0402]  (hidden comment: Resistor)
R122  value 10K  [R0402]  (hidden comment: Resistor)
R123  value 120R  [R0402]  (hidden comment: Resistor)
R124  value 10K  [R0402]  (hidden comment: Resistor)
U20  value MCP2562FDT-H/SN  [ICC_SO8_5X4_P127]  (hidden comment: MCP2562FD)
U21  value MCP2562FDT-H/SN  [ICC_SO8_5X4_P127]  (hidden comment: MCP2562FD)
U22  value MCP2562FDT-H/SN  [ICC_SO8_5X4_P127]  (hidden comment: MCP2562FD)
U26  value ESDCAN05-2BWY  [DIO_SOT323]  (hidden comment: ESD-TRANSIL-DUAL-BIDIR)
U27  value ESDCAN05-2BWY  [DIO_SOT323]  (hidden comment: ESD-TRANSIL-DUAL-BIDIR)
U28  value ESDCAN05-2BWY  [DIO_SOT323]  (hidden comment: ESD-TRANSIL-DUAL-BIDIR)

### Ports
FDCAN1_RX (out), FDCAN1_TX, FDCAN2_RX (out), FDCAN2_TX, FDCAN3_RX (out), FDCAN3_TX

### Nets
3V3: C109.2 C110.2 C111.2 U20.5(VIO) U21.5(VIO) U22.5(VIO)
5V: C98.2 C99.2 C100.2 U20.3(VDD) U21.3(VDD) U22.3(VDD)
GND: C98.1 C99.1 C100.1 C109.1 C110.1 C111.1 R120.2 R122.2 R124.2 U20.2(VSS) U21.2(VSS) U22.2(VSS) U26.3 U27.3 U28.3  [project net POE7]
FDCAN1_RX: U22.4(RXD) ; port FDCAN1_RX
FDCAN1_TX: U22.1(TXD) ; port FDCAN1_TX
FDCAN2_RX: U21.4(RXD) ; port FDCAN2_RX
FDCAN2_TX: U21.1(TXD) ; port FDCAN2_TX
FDCAN3_RX: U20.4(RXD) ; port FDCAN3_RX
FDCAN3_TX: U20.1(TXD) ; port FDCAN3_TX
NetCN16_1: CN16.1 JP4.2(NO) U20.7(CANH) U26.1
NetCN16_2: CN16.2 R119.1 U20.6(CANL) U26.2
NetCN17_1: CN17.1 JP5.2(NO) U21.7(CANH) U27.1
NetCN17_2: CN17.2 R121.1 U21.6(CANL) U27.2
NetCN18_1: CN18.1 JP6.2(NO) U22.7(CANH) U28.1
NetCN18_2: CN18.2 R123.1 U22.6(CANL) U28.2
NetJP4_1: JP4.1(COMMON) R119.2
NetJP5_1: JP5.1(COMMON) R121.2
NetJP6_1: JP6.1(COMMON) R123.2
NetR120_1: R120.1 U20.8(STBY)
NetR122_1: R122.1 U21.8(STBY)
NetR124_1: R124.1 U22.8(STBY)

### Notes on the sheet
- CAN FD
- PH14
- PH13
- PB6
- PB5
- PF7
- PF6
- Title:
- Project:
- Size:
- Revision:
- Variant:
- A4
- -
- Date:
- Reference:
- Sheet:
- of

### Library data of the parts
C98-C100 C109-C111 = MCD-00102: as C34 on sheet Ethernet; Internal_Part_Number: MCD-00102; Status: Released; Part_Type: Capacitor; Package: C0402; ComponentLink1Description: Datasheet; ComponentLink1URL: http://tunmcdsvn.tun.st.com/Component_Datasheet_Library/Trunk/Capacitors/Yageo_Multilayer_Capacitor_X7R_series_100pF_to_22uF
CN16-CN18 = MCD-00314: Header, 2x1, 2.54mm, VR, TH, Height 6mm/3mm; Part_Type: Connector; Manufacturer_Part_Number: PHFS25-11-02-G0B115-T-1; Manufacturer: JIUBABA; Provided_By: SUBCO; Internal_Part_Number: MCD-00314; Value: header 2x1; Status: Released; ComponentLink1Description: Datasheet; ComponentLink1URL: http://tunmcdsvn.tun.st.com/Component_Datasheet_Library/Trunk/Connectors/Jiubaba_PHFS25_11XXXXXXXXXX
JP4-JP6 = MCD-00045: Header, 2x1, 2,54mm, VR, TH, Height 5.84mm/2.54mm; Manufacturer_Part_Number: TSW-102-07-x-S; Manufacturer: SAMTEC; Part_Type: Connector; Alternate_Manufacturer_Part_Number: 313102S111116; Alternate_Manufacturer: JIUBABA; Value: Shunt not fitted; Provided_By: SUBCO; Internal_Part_Number: MCD-00045; Status: Released; ComponentLink1Description: Datasheet; ComponentLink1URL: http://tunmcdsvn.tun.st.com/Component_Datasheet_Library/Trunk/Connectors/Samtec_TSW-HTSW-series
R119 R121 R123 = MCD-00194: Resistor,120R,0402,1%,1/16W; Manufacturer_Part_Number: RC0402FR-07120RL; Manufacturer: YAGEO; Provided_By: SUBCO; Internal_Part_Number: MCD-00194; Status: Released; Part_Type: Resistor; Package: R0402; ComponentLink1Description: Datasheet; ComponentLink1URL: http://tunmcdsvn.tun.st.com/Component_Datasheet_Library/Trunk/Resistors/Yageo_Resistor_RC0402-series
R120 R122 R124 = MCD-00053: as R70 on sheet Ethernet; Internal_Part_Number: MCD-00053; Status: Released; Part_Type: Resistor; Package: R0402; ComponentLink1Description: Datasheet; ComponentLink1URL: http://tunmcdsvn.tun.st.com/Component_Datasheet_Library/Trunk/Resistors/Yageo_Resistor_RC0402-series
U20-U22 = MCD-00129: High-Speed CAN Flexible Data Rate Transceiver; Part_Type: IC; Manufacturer: MICROCHIP; Provided_By: SUBCO; Internal_Part_Number: MCD-00129; Status: Released; Manufacturer_Part_Number: MCP2562FDT-H/SN; ComponentLink1Description: Datasheet; ComponentLink1URL: http://tunmcdsvn.tun.st.com/Component_Datasheet_Library/Trunk/IC/Microchip_CAN Transceiver_MCP2562FD
U26-U28 = MCD-01358: Automotive dual-line Transil, transient voltage suppressor (TVS) for CAN bus 36V. Compliant with interfaces in automotive: CAN-FD, LIN, FlexRay, MOST, SENT, USB; Part_Type: Diode; Manufacturer: STMICROELECTRONICS; BMS_Part_Number: 9179021; ECCN_US: EAR99; ECCN_EU: NEC; Provided_By: SUBCO with ST control; Internal_Part_Number: MCD-01358; Status: Released; Manufacturer_Part_Number: ESDCAN05-2BWY; Package: SOT323-3L; ComponentLink1Description: Datasheet; ComponentLink1URL: http://tunmcdsvn.tun.st.com/Component_Datasheet_Library/Trunk/Diodes/STM_ESD_ESDCAN02-2BWY